# Altium schematic sheet 07_eMMC.SchDoc
size 420 x 297 mm; SheetNumber: 14; SheetTotal: 24
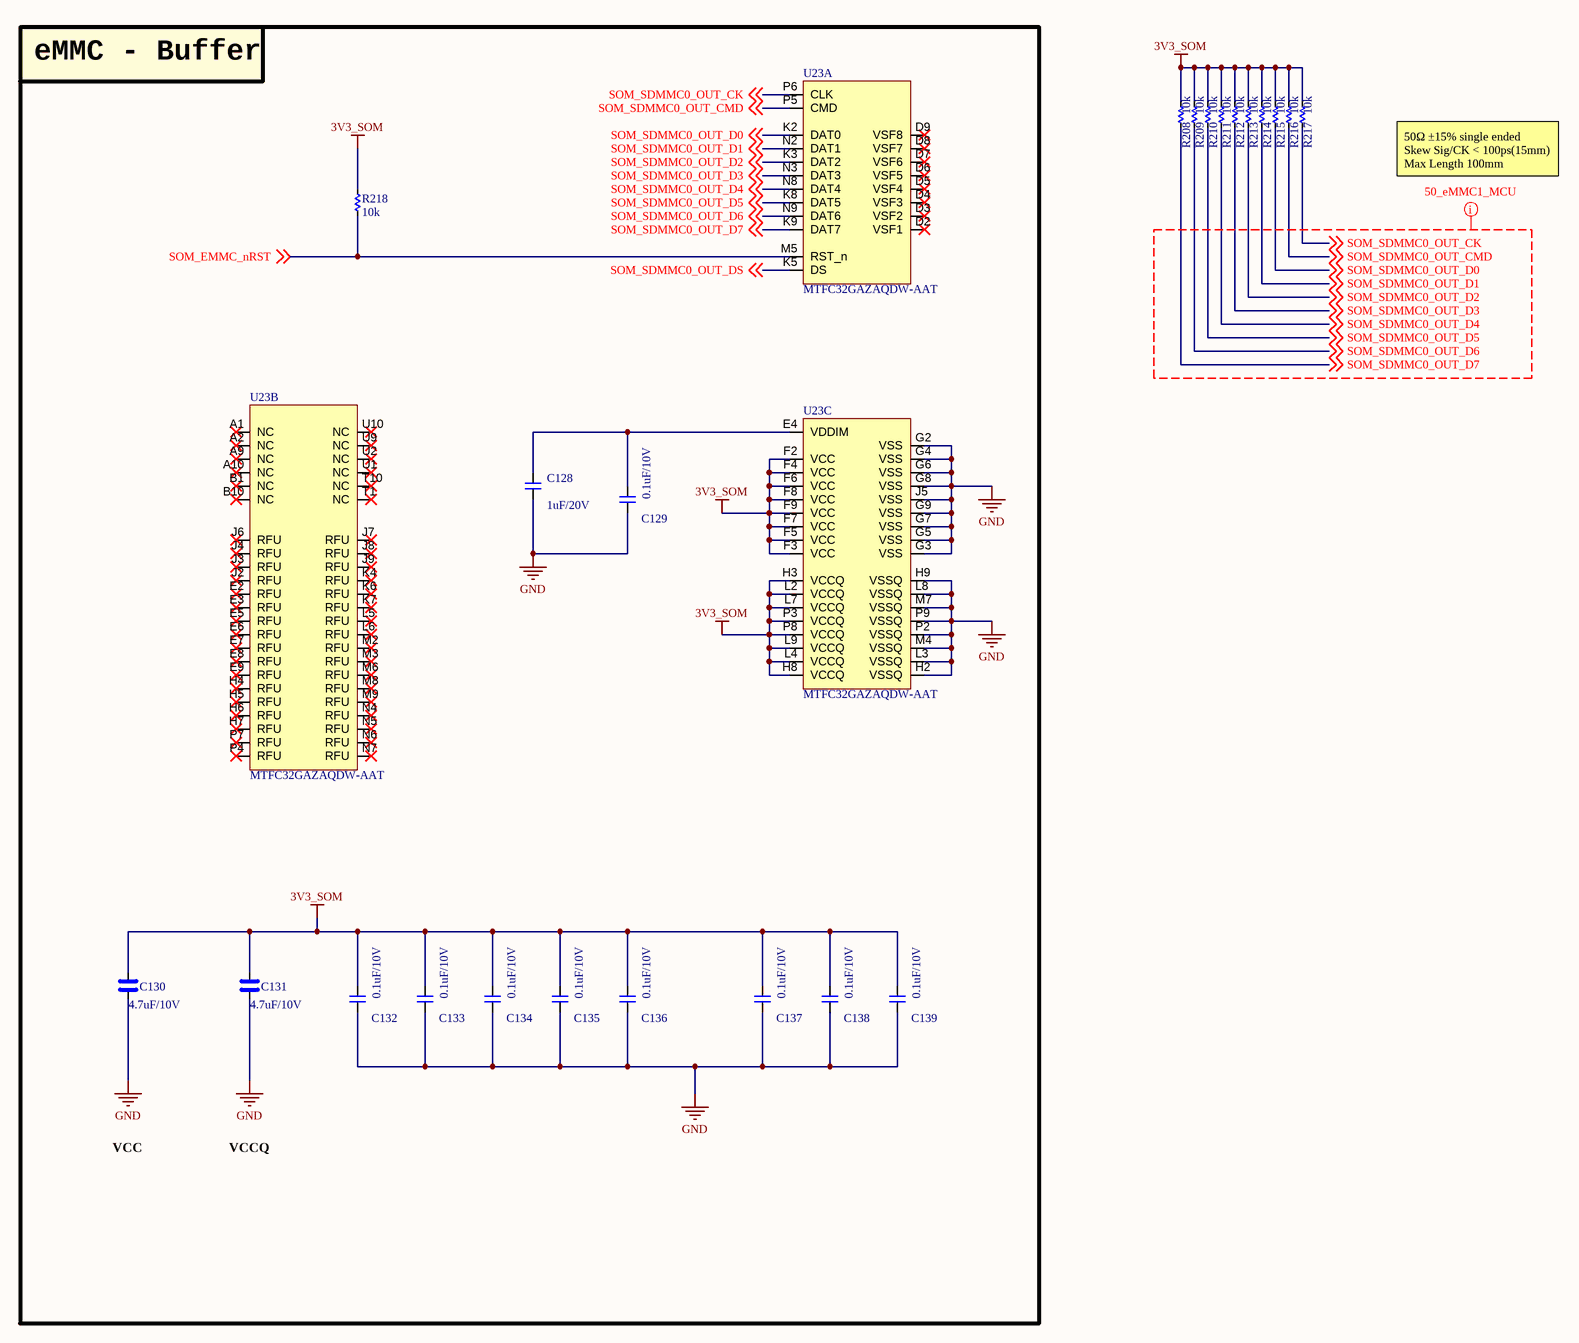
[diagram p0: 07_eMMC.SchDoc]

## Parts
C128  1uF/20V  [CAP_C_1005X60]
C129  0.1uF/10V  [CAP_C_1005X60]
C130  4.7uF/10V  [CAP_C_1608X80]
C131  4.7uF/10V  [CAP_C_1608X80]
C132  0.1uF/10V  [CAP_C_1005X60]
C133  0.1uF/10V  [CAP_C_1005X60]
C134  0.1uF/10V  [CAP_C_1005X60]
C135  0.1uF/10V  [CAP_C_1005X60]
C136  0.1uF/10V  [CAP_C_1005X60]
C137  0.1uF/10V  [CAP_C_1005X60]
C138  0.1uF/10V  [CAP_C_1005X60]
C139  0.1uF/10V  [CAP_C_1005X60]
R208  10k  [RES_C_1005X40]
R209  10k  [RES_C_1005X40]
R210  10k  [RES_C_1005X40]
R211  10k  [RES_C_1005X40]
R212  10k  [RES_C_1005X40]
R213  10k  [RES_C_1005X40]
R214  10k  [RES_C_1005X40]
R215  10k  [RES_C_1005X40]
R216  10k  [RES_C_1005X40]
R217  10k  [RES_C_1005X40]
R218  10k  [RES_C_1005X40]
U23  MTFC32GAZAQDW-AAT  [BGA_100_C_100P_10X17_1400X1800X150]  (parts A,B,C of 3)

## Blocks framed on the sheet
eMMC - Buffer: C128-C139 R218 U23

## Nets
3V3_SOM: C130.2 C131.2 C132.2 C133.2 C134.2 C135.2 C136.2 C137.2 C138.2 C139.2 R208.2 R209.2 R210.2 R211.2 R212.2 R213.2 R214.2 R215.2 R216.2 R217.2 R218.2 U23.F2(VCC) U23.F3(VCC) U23.F4(VCC) U23.F5(VCC) U23.F6(VCC) U23.F7(VCC) U23.F8(VCC) U23.F9(VCC) U23.H3(VCCQ) U23.H8(VCCQ) U23.L2(VCCQ) U23.L4(VCCQ) U23.L7(VCCQ) U23.L9(VCCQ) U23.P3(VCCQ) U23.P8(VCCQ)
GND: C128.1 C129.1 C130.1 C131.1 C132.1 C133.1 C134.1 C135.1 C136.1 C137.1 C138.1 C139.1 U23.G2(VSS) U23.G3(VSS) U23.G4(VSS) U23.G5(VSS) U23.G6(VSS) U23.G7(VSS) U23.G8(VSS) U23.G9(VSS) U23.H2(VSSQ) U23.H9(VSSQ) U23.J5(VSS) U23.L3(VSSQ) U23.L8(VSSQ) U23.M4(VSSQ) U23.M7(VSSQ) U23.P2(VSSQ) U23.P9(VSSQ)
SOM_EMMC_nRST: R218.1 U23.M5(RST_n) ; off-sheet SOM_EMMC_nRST
SOM_SDMMC0_OUT_CK: R217.1 U23.P6(CLK) ; off-sheet SOM_SDMMC0_OUT_CK
SOM_SDMMC0_OUT_CMD: R216.1 U23.P5(CMD) ; off-sheet SOM_SDMMC0_OUT_CMD
SOM_SDMMC0_OUT_D0: R215.1 U23.K2(DAT0) ; off-sheet SOM_SDMMC0_OUT_D0
SOM_SDMMC0_OUT_D1: R214.1 U23.N2(DAT1) ; off-sheet SOM_SDMMC0_OUT_D1
SOM_SDMMC0_OUT_D2: R213.1 U23.K3(DAT2) ; off-sheet SOM_SDMMC0_OUT_D2
SOM_SDMMC0_OUT_D3: R212.1 U23.N3(DAT3) ; off-sheet SOM_SDMMC0_OUT_D3
SOM_SDMMC0_OUT_D4: R211.1 U23.N8(DAT4) ; off-sheet SOM_SDMMC0_OUT_D4
SOM_SDMMC0_OUT_D5: R210.1 U23.K8(DAT5) ; off-sheet SOM_SDMMC0_OUT_D5
SOM_SDMMC0_OUT_D6: R209.1 U23.N9(DAT6) ; off-sheet SOM_SDMMC0_OUT_D6
SOM_SDMMC0_OUT_D7: R208.1 U23.K9(DAT7) ; off-sheet SOM_SDMMC0_OUT_D7
SOM_SDMMC0_OUT_DS: U23.K5(DS) ; off-sheet SOM_SDMMC0_OUT_DS
NetC128_2: C128.2 C129.2 U23.E4(VDDIM)

Not connected (* = marked no-connect by the designer): U23 A1(NC)* A2(NC)* A9(NC)* A10(NC)* B1(NC)* B10(NC)* D2(VSF1)* D3(VSF2)* D4(VSF3)* D5(VSF4)* D6(VSF5)* D7(VSF6)* D8(VSF7)* D9(VSF8)* E2(RFU)* E3(RFU)* E5(RFU)* E6(RFU)* E7(RFU)* E8(RFU)* E9(RFU)* H4(RFU)* H5(RFU)* H6(RFU)* H7(RFU)* J2(RFU)* J3(RFU)* J4(RFU)* J6(RFU)* J7(RFU)* J8(RFU)* J9(RFU)* K4(RFU)* K6(RFU)* K7(RFU)* L5(RFU)* L6(RFU)* M2(RFU)* M3(RFU)* M6(RFU)* M8(RFU)* M9(RFU)* N4(RFU)* N5(RFU)* N6(RFU)* N7(RFU)* P4(RFU)* P7(RFU)* T1(NC)* T10(NC)* U1(NC)* U2(NC)* U9(NC)* U10(NC)*

## Layout directives
net class 50_eMMC1_MCU: SOM_SDMMC0_OUT_CK, SOM_SDMMC0_OUT_CMD, SOM_SDMMC0_OUT_D0, SOM_SDMMC0_OUT_D1, SOM_SDMMC0_OUT_D2, SOM_SDMMC0_OUT_D3, SOM_SDMMC0_OUT_D4, SOM_SDMMC0_OUT_D5, SOM_SDMMC0_OUT_D6, SOM_SDMMC0_OUT_D7

## Notes on the sheet
- 50Ω ±15% single ended
  Skew Sig/CK < 100ps(15mm)
  Max Length 100mm
- VCC
- VCCQ
- Project:
- BEE-PC1
- Sub-system:
- NANORACK_EXP_CONTROLLER
- Design by:
- SANG HUYNH
- BAO BUI Q.
- Sheet title:
- Sheet
- A3
- of
- Checked by:
- Approved by:
- VU PHAM
- Revision:
- Document No:
- V1.2.2
- Size:
- Date:

## Library data of the parts
C128 C129 C132-C139 = _CAP_C_2: CAP CHIP
C130 C131 = _CAP_C_High_2: CAP CHIP High Value
R208-R218 = _RES_B_2: RES